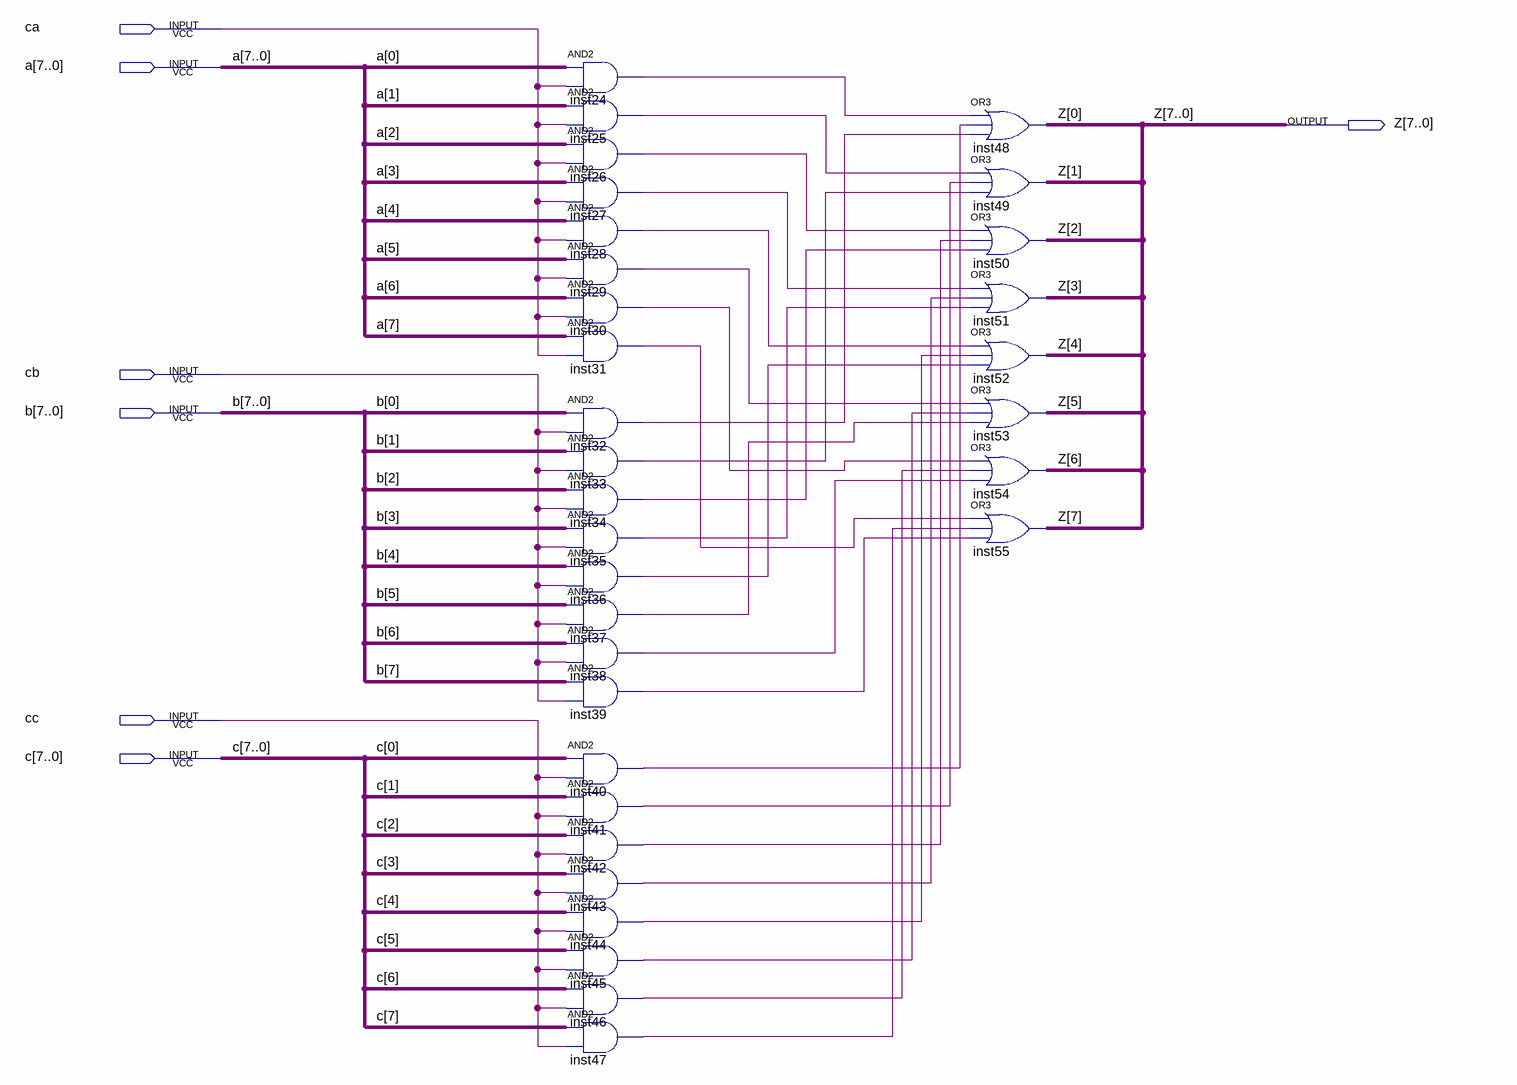
[diagram p0: schematic sheet]
// Quartus schematic choose_3.bdf as structural Verilog: 32 symbols, 7 pins
module choose_3 (
  input  ca,
  input  [7:0] a,
  input  cb,
  input  [7:0] b,
  input  cc,
  input  [7:0] c,
  output [7:0] Z
);

  wire inst24_out, inst25_out, inst26_out, inst27_out, inst28_out, inst29_out, inst30_out, inst31_out,
       inst32_out, inst33_out, inst34_out, inst35_out, inst36_out, inst37_out, inst38_out, inst39_out,
       inst40_out, inst41_out, inst42_out, inst43_out, inst44_out, inst45_out, inst46_out, inst47_out;

  and inst24 (inst24_out, a[0], ca);
  and inst25 (inst25_out, a[1], ca);
  and inst26 (inst26_out, a[2], ca);
  and inst27 (inst27_out, a[3], ca);
  and inst28 (inst28_out, a[4], ca);
  and inst29 (inst29_out, a[5], ca);
  and inst30 (inst30_out, a[6], ca);
  and inst31 (inst31_out, a[7], ca);
  and inst32 (inst32_out, b[0], cb);
  and inst33 (inst33_out, b[1], cb);
  and inst34 (inst34_out, b[2], cb);
  and inst35 (inst35_out, b[3], cb);
  and inst36 (inst36_out, b[4], cb);
  and inst37 (inst37_out, b[5], cb);
  and inst38 (inst38_out, b[6], cb);
  and inst39 (inst39_out, b[7], cb);
  and inst40 (inst40_out, c[0], cc);
  and inst41 (inst41_out, c[1], cc);
  and inst42 (inst42_out, c[2], cc);
  and inst43 (inst43_out, c[3], cc);
  and inst44 (inst44_out, c[4], cc);
  and inst45 (inst45_out, c[5], cc);
  and inst46 (inst46_out, c[6], cc);
  and inst47 (inst47_out, c[7], cc);
  or inst48 (Z[0], inst24_out, inst40_out, inst32_out);
  or inst49 (Z[1], inst25_out, inst41_out, inst33_out);
  or inst50 (Z[2], inst26_out, inst42_out, inst34_out);
  or inst51 (Z[3], inst27_out, inst43_out, inst35_out);
  or inst52 (Z[4], inst28_out, inst44_out, inst36_out);
  or inst53 (Z[5], inst29_out, inst45_out, inst37_out);
  or inst54 (Z[6], inst30_out, inst46_out, inst38_out);
  or inst55 (Z[7], inst31_out, inst47_out, inst39_out);
endmodule
